# Altium schematic sheet HW-590W-0625-SCH-天德钰方案.SchDoc
size 566 x 736 mm; SheetNumber: 1; SheetTotal: 1
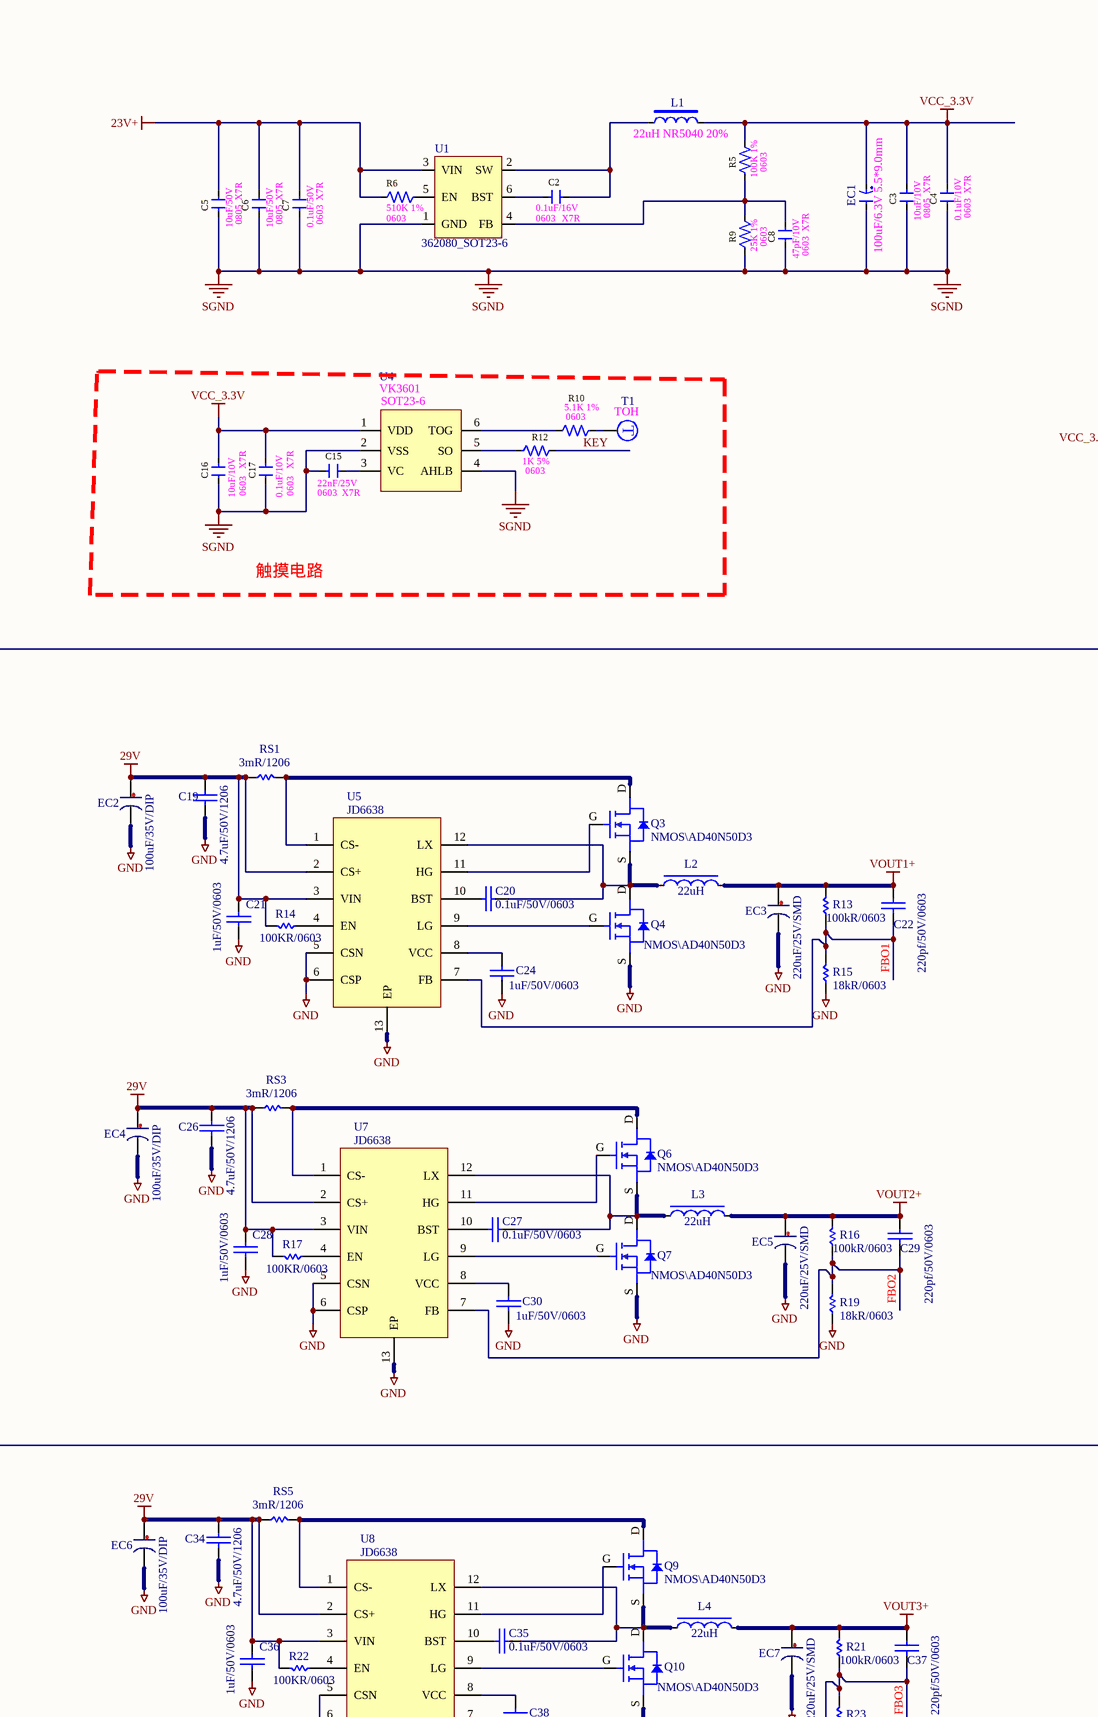
[diagram p0: HW-590W-0625-SCH-天德钰方案.SchDoc, top left]
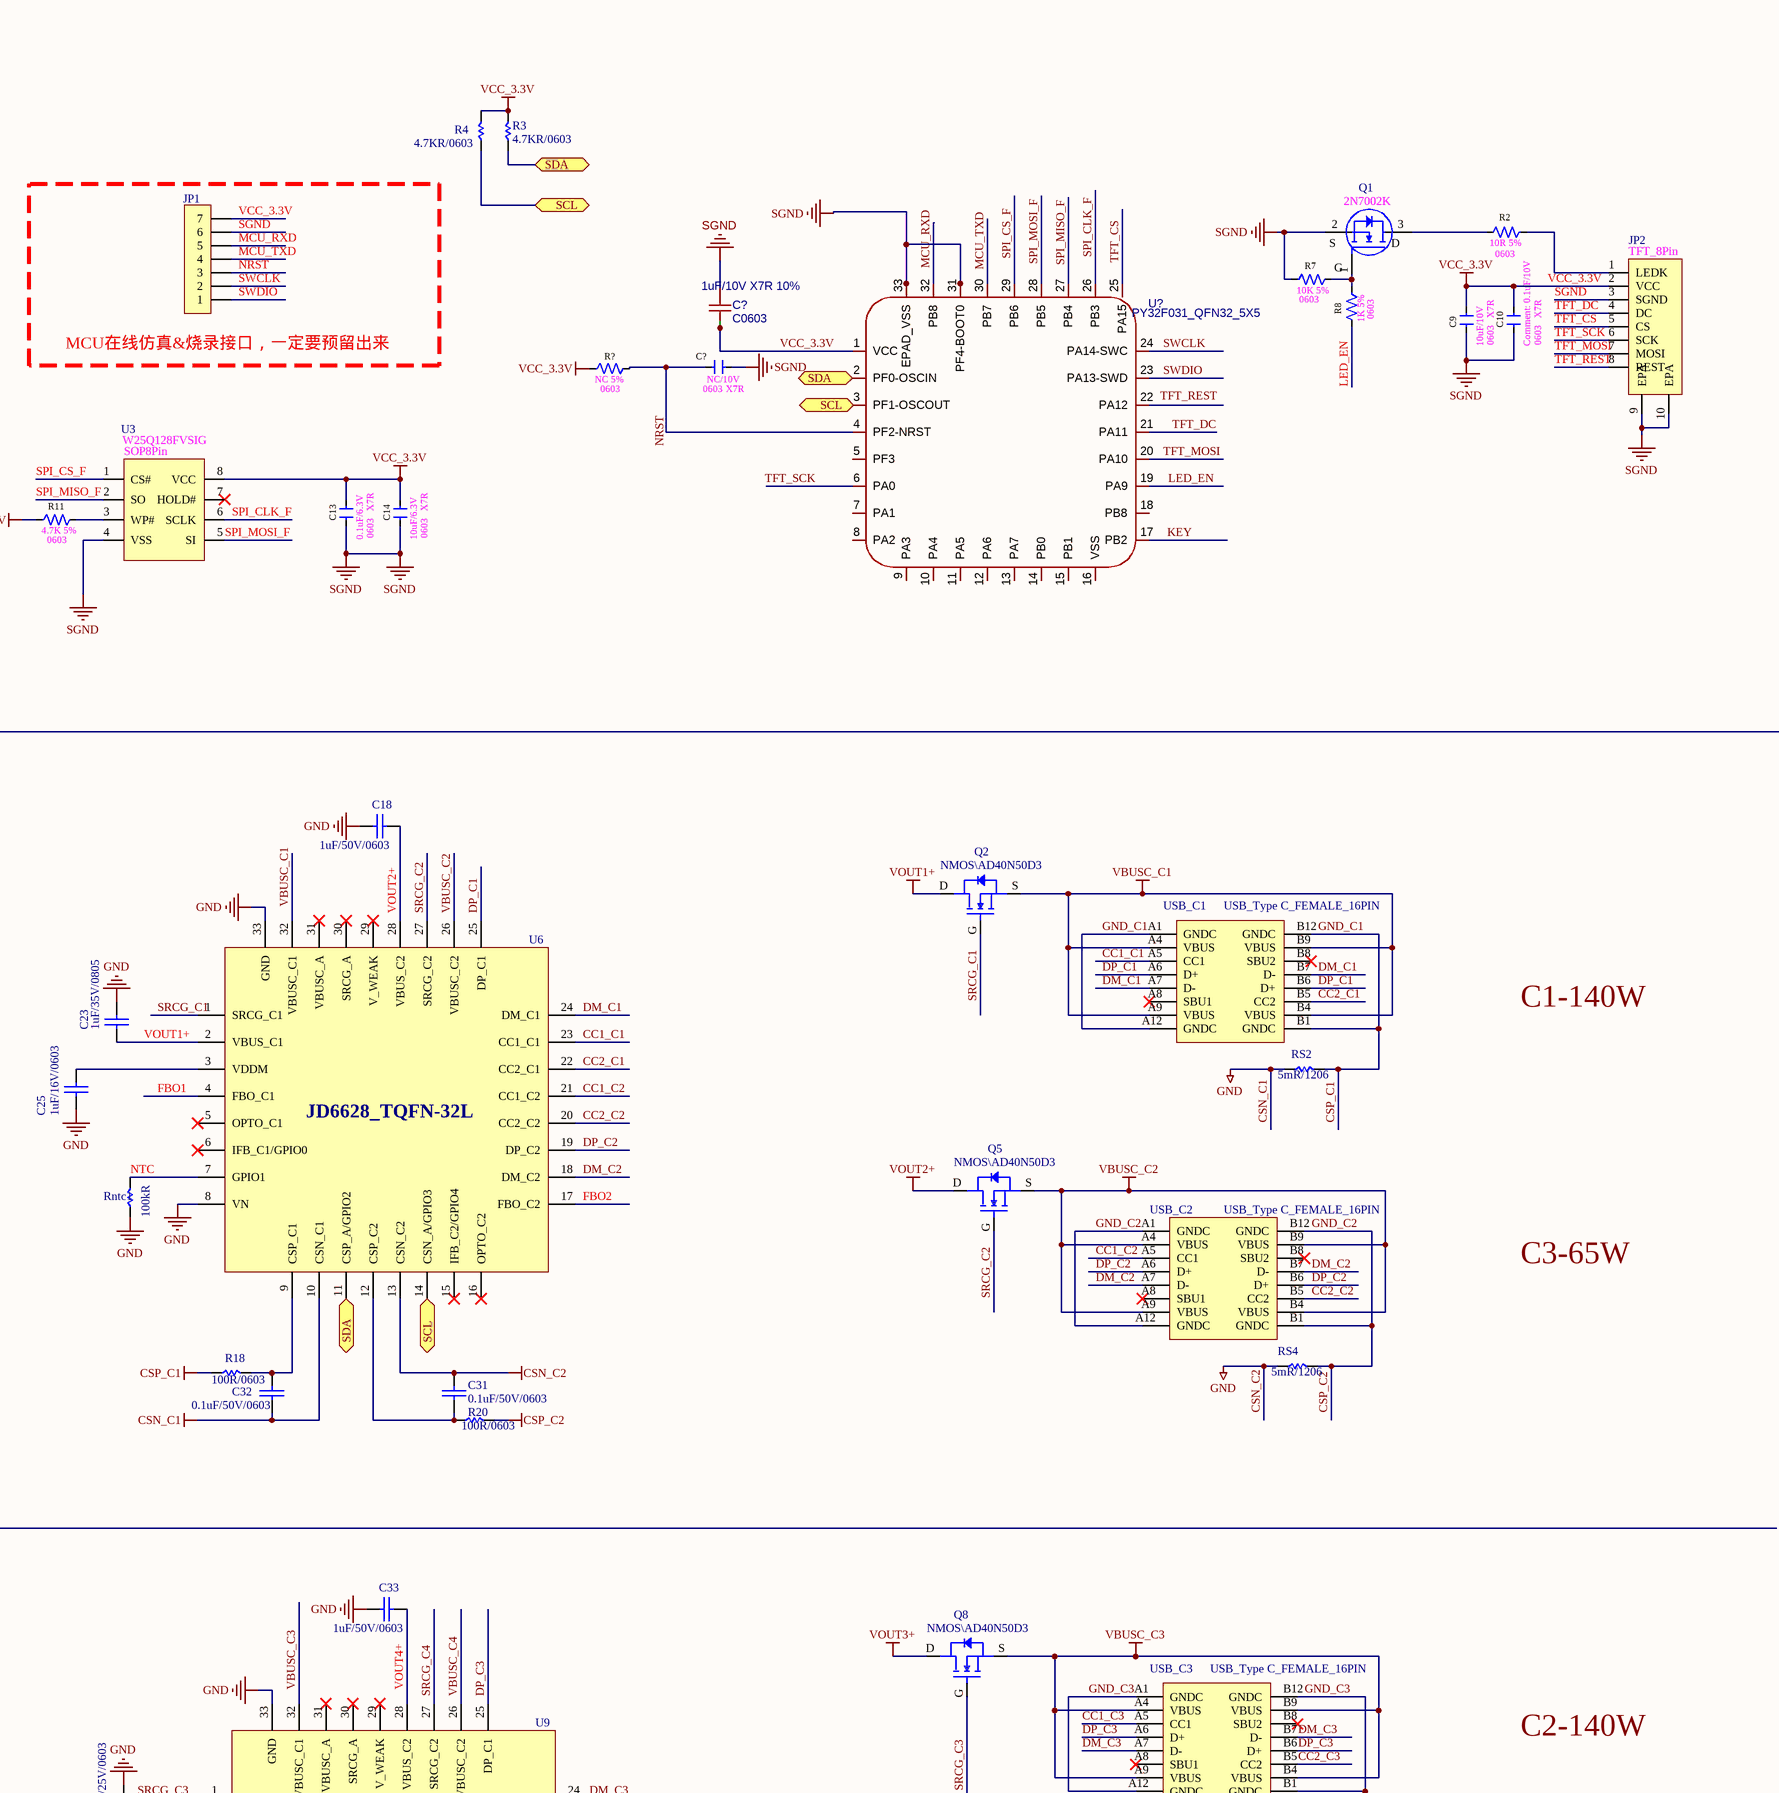
[diagram p1: HW-590W-0625-SCH-天德钰方案.SchDoc, top right]
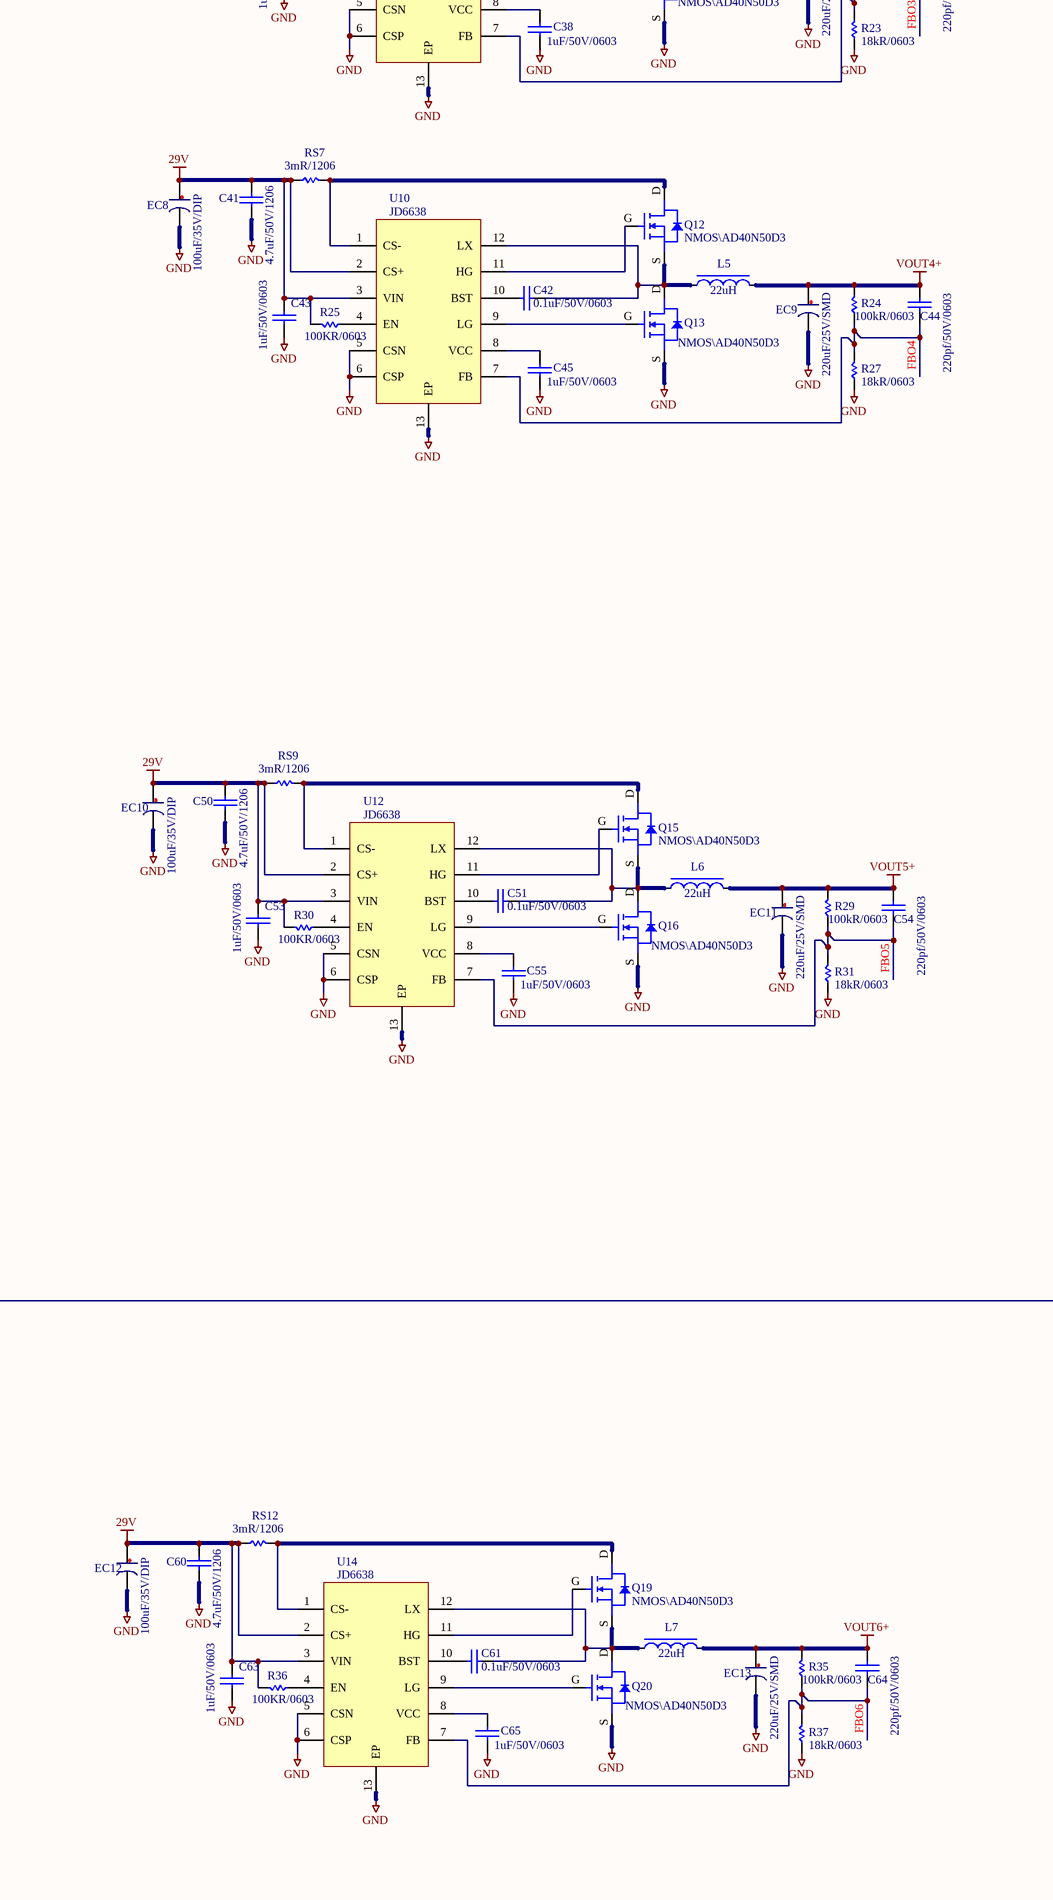
[diagram p2: HW-590W-0625-SCH-天德钰方案.SchDoc, bottom left]
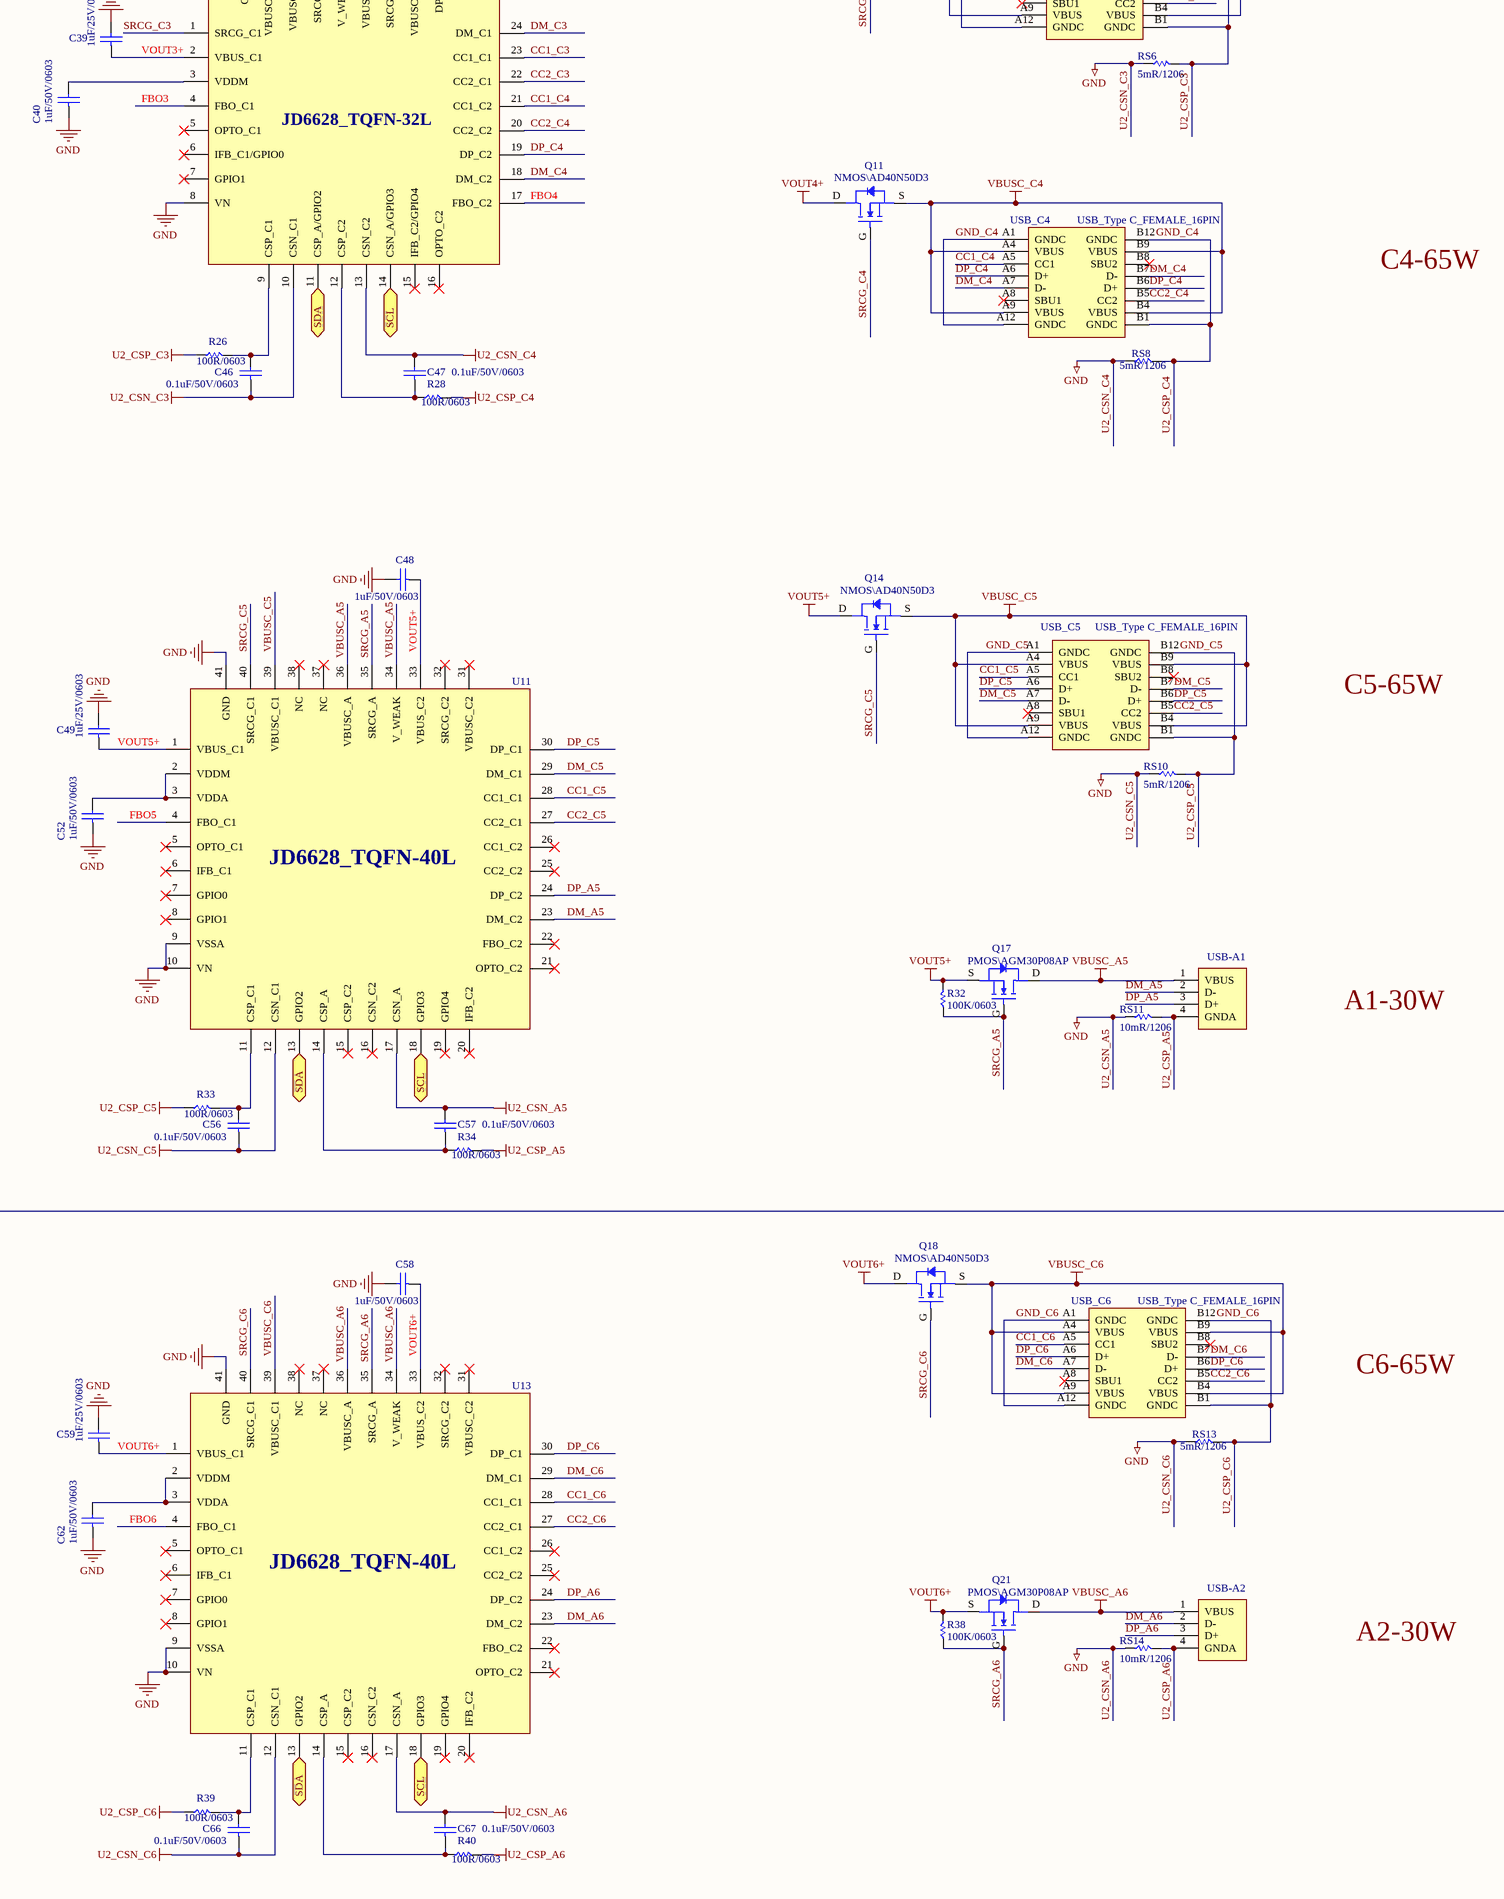
[diagram p3: HW-590W-0625-SCH-天德钰方案.SchDoc, bottom right]

## Parts
(Parts that share a designator on the sheet are numbered #1, #2 ... from top to bottom, then left to right.)
C2  0.1uF/16V  封装: 0603  材质: X7R  [SMD-C0603 锡膏]
C3  10uF/10V  封装: 0805  材质: X7R  [SMD-C0805 锡膏]
C4  0.1uF/10V  封装: 0603  材质: X7R  [SMD-C0603 锡膏]
C5  10uF/50V  封装: 0805  材质: X7R  [SMD-C0805 锡膏]
C6  10uF/50V  封装: 0805  材质: X7R  [SMD-C0805 锡膏]
C7  0.1uF/50V  封装: 0603  材质: X7R  [SMD-C0603 锡膏]
C8  47pF/10V  封装: 0603  材质: X7R  [SMD-C0603 锡膏]
C9  10uF/10V  封装: 0603  材质: X7R  [SMD-C0603 锡膏]
C10  0.1uF/10V  封装: 0603  材质: X7R  [SMD-C0603 锡膏]
C13  0.1uF/6.3V  封装: 0603  材质: X7R  [SMD-C0603 锡膏]
C14  10uF/6.3V  封装: 0603  材质: X7R  [SMD-C0603 锡膏]
C15  22nF/25V  封装: 0603  材质: X7R  [SMD-C0603 锡膏]
C16  10uF/10V  封装: 0603  材质: X7R  [SMD-C0603 锡膏]
C17  0.1uF/10V  封装: 0603  材质: X7R  [SMD-C0603 锡膏]
C18  1uF/50V/0603  [C0603]
C19  4.7uF/50V/1206  [C0603]
C20  0.1uF/50V/0603  [C0603]
C21  1uF/50V/0603  [C0603]
C22  220pf/50V/0603  [C0603]
C23  1uF/35V/0805  [C0603]
C24  1uF/50V/0603  [C0603]
C25  1uF/16V/0603  [C0603]
C26  4.7uF/50V/1206  [C0603]
C27  0.1uF/50V/0603  [C0603]
C28  1uF/50V/0603  [C0603]
C29  220pf/50V/0603  [C0603]
C30  1uF/50V/0603  [C0603]
C31  0.1uF/50V/0603  [C0603]
C32  0.1uF/50V/0603  [C0603]
C33  1uF/50V/0603  [C0603]
C34  4.7uF/50V/1206  [C0603]
C35  0.1uF/50V/0603  [C0603]
C36  1uF/50V/0603  [C0603]
C37  220pf/50V/0603  [C0603]
C38  1uF/50V/0603  [C0603]
C39  1uF/25V/0603  [C0603]
C40  1uF/50V/0603  [C0603]
C41  4.7uF/50V/1206  [C0603]
C42  0.1uF/50V/0603  [C0603]
C43  1uF/50V/0603  [C0603]
C44  220pf/50V/0603  [C0603]
C45  1uF/50V/0603  [C0603]
C46  0.1uF/50V/0603  [C0603]
C47  0.1uF/50V/0603  [C0603]
C48  1uF/50V/0603  [C0603]
C49  1uF/25V/0603  [C0603]
C50  4.7uF/50V/1206  [C0603]
C51  0.1uF/50V/0603  [C0603]
C52  1uF/50V/0603  [C0603]
C53  1uF/50V/0603  [C0603]
C54  220pf/50V/0603  [C0603]
C55  1uF/50V/0603  [C0603]
C56  0.1uF/50V/0603  [C0603]
C57  0.1uF/50V/0603  [C0603]
C58  1uF/50V/0603  [C0603]
C59  1uF/25V/0603  [C0603]
C60  4.7uF/50V/1206  [C0603]
C61  0.1uF/50V/0603  [C0603]
C62  1uF/50V/0603  [C0603]
C63  1uF/50V/0603  [C0603]
C64  220pf/50V/0603  [C0603]
C65  1uF/50V/0603  [C0603]
C66  0.1uF/50V/0603  [C0603]
C67  0.1uF/50V/0603  [C0603]
C?#1  1uF/10V X7R 10%  value C0603  [C0603]
C?#2  NC/10V  封装: 0603  材质: X7R  [SMD-C0603 锡膏]
EC1  100uF/6.3V 5.5*9.0mm  [DIP-CAP 2.5mm 6.3*7mm 立式]
EC2  100uF/35V/DIP  [CE\P3.5mm\D8mm]
EC3  220uF/25V/SMD  [CE\P3.5mm\D8mm]
EC4  100uF/35V/DIP  [CE\P3.5mm\D8mm]
EC5  220uF/25V/SMD  [CE\P3.5mm\D8mm]
EC6  100uF/35V/DIP  [CE\P3.5mm\D8mm]
EC7  220uF/25V/SMD  [CE\P3.5mm\D8mm]
EC8  100uF/35V/DIP  [CE\P3.5mm\D8mm]
EC9  220uF/25V/SMD  [CE\P3.5mm\D8mm]
EC10  100uF/35V/DIP  [CE\P3.5mm\D8mm]
EC11  220uF/25V/SMD  [CE\P3.5mm\D8mm]
EC12  100uF/35V/DIP  [CE\P3.5mm\D8mm]
EC13  220uF/25V/SMD  [CE\P3.5mm\D8mm]
JP1  HDR-1X7  [HDR-1X7]  (value not drawn)
JP2  TFT_8Pin  [FPC_8P 0.5MM]
L1  22uH NR5040 20%  [SMD-L NR5040 锡膏]
L2  22uH  [IND\AMPI0630\5.9MM(DIP+SMD)]
L3  22uH  [IND\AMPI0630\5.9MM(DIP+SMD)]
L4  22uH  [IND\AMPI0630\5.9MM(DIP+SMD)]
L5  22uH  [IND\AMPI0630\5.9MM(DIP+SMD)]
L6  22uH  [IND\AMPI0630\5.9MM(DIP+SMD)]
L7  22uH  [IND\AMPI0630\5.9MM(DIP+SMD)]
Q1  2N7002K  [SOT23-3 红胶]
Q2  NMOS\AD40N50D3  [MOS\SOP-8]
Q3  NMOS\AD40N50D3  [MOS\DFN-8(3x3)]
Q4  NMOS\AD40N50D3  [MOS\DFN-8(3x3)]
Q5  NMOS\AD40N50D3  [MOS\SOP-8]
Q6  NMOS\AD40N50D3  [MOS\DFN-8(3x3)]
Q7  NMOS\AD40N50D3  [MOS\DFN-8(3x3)]
Q8  NMOS\AD40N50D3  [MOS\SOP-8]
Q9  NMOS\AD40N50D3  [MOS\DFN-8(3x3)]
Q10  NMOS\AD40N50D3  [MOS\DFN-8(3x3)]
Q11  NMOS\AD40N50D3  [MOS\SOP-8]
Q12  NMOS\AD40N50D3  [MOS\DFN-8(3x3)]
Q13  NMOS\AD40N50D3  [MOS\DFN-8(3x3)]
Q14  NMOS\AD40N50D3  [MOS\SOP-8]
Q15  NMOS\AD40N50D3  [MOS\DFN-8(3x3)]
Q16  NMOS\AD40N50D3  [MOS\DFN-8(3x3)]
Q17  PMOS\AGM30P08AP  [MOS\SOP-8]
Q18  NMOS\AD40N50D3  [MOS\SOP-8]
Q19  NMOS\AD40N50D3  [MOS\DFN-8(3x3)]
Q20  NMOS\AD40N50D3  [MOS\DFN-8(3x3)]
Q21  PMOS\AGM30P08AP  [MOS\SOP-8]
R2  10R 5%  封装: 0603  [SMD-R0603 锡膏]
R3  4.7KR/0603  [R0603]
R4  4.7KR/0603  [R0603]
R5  100K 1%  封装: 0603  [SMD-R0603 锡膏]
R6  510K 1%  封装: 0603  [SMD-R0603 锡膏]
R7  10K 5%  封装: 0603  [SMD-R0603 锡膏]
R8  1K 5%  封装: 0603  [SMD-R0603 锡膏]
R9  25K 1%  封装: 0603  [SMD-R0603 锡膏]
R10  5.1K 1%  封装: 0603  [SMD-R0603 锡膏]
R11  4.7K 5%  封装: 0603  [SMD-R0603 锡膏]
R12  1K 5%  封装: 0603  [SMD-R0603 锡膏]
R13  100kR/0603  [R0603]
R14  100KR/0603  [R0603S]
R15  18kR/0603  [R0603]
R16  100kR/0603  [R0603]
R17  100KR/0603  [R0603S]
R18  100R/0603  [R0603]
R19  18kR/0603  [R0603]
R20  100R/0603  [R0603]
R21  100kR/0603  [R0603]
R22  100KR/0603  [R0603S]
R23  18kR/0603  [R0603]
R24  100kR/0603  [R0603]
R25  100KR/0603  [R0603S]
R26  100R/0603  [R0603]
R27  18kR/0603  [R0603]
R28  100R/0603  [R0603]
R29  100kR/0603  [R0603]
R30  100KR/0603  [R0603S]
R31  18kR/0603  [R0603]
R32  100K/0603  [R0603]
R33  100R/0603  [R0603]
R34  100R/0603  [R0603]
R35  100kR/0603  [R0603]
R36  100KR/0603  [R0603S]
R37  18kR/0603  [R0603]
R38  100K/0603  [R0603]
R39  100R/0603  [R0603]
R40  100R/0603  [R0603]
R?  NC 5%  封装: 0603  [SMD-R0603 锡膏]
Rntc1  100kR  [R0603]
RS1  3mR/1206  [R1206]
RS2  5mR/1206  [R2512]
RS3  3mR/1206  [R1206]
RS4  5mR/1206  [R2512]
RS5  3mR/1206  [R1206]
RS6  5mR/1206  [R2512]
RS7  3mR/1206  [R1206]
RS8  5mR/1206  [R2512]
RS9  3mR/1206  [R1206]
RS10  5mR/1206  [R2512]
RS11  10mR/1206  [R2512]
RS12  3mR/1206  [R1206]
RS13  5mR/1206  [R2512]
RS14  10mR/1206  [R2512]
T1  TOH  [Test Point]
U1  362080_SOT23-6  [SOT23-6]
U3  W25Q128FVSIG  Fotprintf: SOP8Pin  [SOP_8L 锡膏]
U4  VK3601  Footprintf: SOT23-6  [SOT23-6 锡膏]
U5  JD6638_TDFN_12L  [TDFN_3X3_12L]  (value not drawn)
U6  JD6628_TQFN-32L  [IC\QFN-32\0.4mm\4x4mm]
U7  JD6638_TDFN_12L  [TDFN_3X3_12L]  (value not drawn)
U8  JD6638_TDFN_12L  [TDFN_3X3_12L]  (value not drawn)
U9  JD6628_TQFN-32L  [IC\QFN-32\0.4mm\4x4mm]
U10  JD6638_TDFN_12L  [TDFN_3X3_12L]  (value not drawn)
U11  JD6628_TQFN-40L  [QFN5*5-40L]
U12  JD6638_TDFN_12L  [TDFN_3X3_12L]  (value not drawn)
U13  JD6628_TQFN-40L  [QFN5*5-40L]
U14  JD6638_TDFN_12L  [TDFN_3X3_12L]  (value not drawn)
U?  PY32F031_QFN32_5X5
USB-A1  USB_Type A_FEMALE_SMD_Short  [USB_USAF-041N-4WV611]  (value not drawn)
USB-A2  USB_Type A_FEMALE_SMD_Short  [USB_USAF-041N-4WV611]  (value not drawn)
USB_C1  USB_Type C_FEMALE_16PIN  [USB_SBC-160S1-20-S235]
USB_C2  USB_Type C_FEMALE_16PIN  [USB_SBC-160S1-20-S235]
USB_C3  USB_Type C_FEMALE_16PIN  [USB_SBC-160S1-20-S235]
USB_C4  USB_Type C_FEMALE_16PIN  [USB_SBC-160S1-20-S235]
USB_C5  USB_Type C_FEMALE_16PIN  [USB_SBC-160S1-20-S235]
USB_C6  USB_Type C_FEMALE_16PIN  [USB_SBC-160S1-20-S235]

## Blocks framed on the sheet
MCU在线仿真&烧录接口，一定要预留出来: JP1
触摸电路: C15-C17 R10 R12 T1 U4

## Ports
SCL (bidir), SDA (bidir)

## Nets
23V+: C5.1 C6.1 C7.1 R6.1 U1.3(VIN)
29V: C19.2 C21.2 C26.2 C28.2 C34.2 C36.2 C41.2 C43.2 C50.2 C53.2 C60.2 C63.2 EC2.1 EC4.1 EC6.1 EC8.1 EC10.1 EC12.1 R14.2 R17.2 R22.2 R25.2 R30.2 R36.2 RS1.1 RS3.1 RS5.1 RS7.1 RS9.1 RS12.1 U5.2(CS+) U5.3(VIN) U7.2(CS+) U7.3(VIN) U8.2(CS+) U8.3(VIN) U10.2(CS+) U10.3(VIN) U12.2(CS+) U12.3(VIN) U14.2(CS+) U14.3(VIN)
CSN_C1: C18.2 C19.1 C21.1 C23.2 C24.1 C25.1 C26.1 C28.1 C30.1 C31.2 C32.1 C33.2 C34.1 C36.1 C38.1 C39.2 C40.1 C41.1 C43.1 C45.1 C46.1 C47.2 C48.2 C49.2 C50.1 C52.1 C53.1 C55.1 C56.1 C57.2 C58.2 C59.2 C60.1 C62.1 C63.1 C65.1 C66.1 C67.2 EC2.2 EC3.2 EC4.2 EC5.2 EC6.2 EC7.2 EC8.2 EC9.2 EC10.2 EC11.2 EC12.2 EC13.2 Q4.S Q7.S Q10.S Q13.S Q16.S Q20.S R15.1 R19.1 R23.1 R27.1 R31.1 R37.1 Rntc1.1 RS2.1 RS4.1 RS6.1 RS8.1 RS10.1 RS11.1 RS13.1 RS14.1 U5.5(CSN) U5.6(CSP) U5.13(EP) U6.8(VN) U6.10(CSN_C1) U6.13(CSN_C2) U6.33(GND) U7.5(CSN) U7.6(CSP) U7.13(EP) U8.5(CSN) U8.6(CSP) U8.13(EP) U9.8(VN) U9.10(CSN_C1) U9.13(CSN_C2) U9.33(GND) U10.5(CSN) U10.6(CSP) U10.13(EP) U11.9(VSSA) U11.10(VN) U11.12(CSN_C1) U11.17(CSN_A) U11.41(GND) U12.5(CSN) U12.6(CSP) U12.13(EP) U13.9(VSSA) U13.10(VN) U13.12(CSN_C1) U13.17(CSN_A) U13.41(GND) U14.5(CSN) U14.6(CSP) U14.13(EP)  [also labelled CSN_C2, GND, U2_CSN_A5, U2_CSN_A6, U2_CSN_C3, U2_CSN_C4, U2_CSN_C5, U2_CSN_C6]
CSP_C1: R18.1 RS2.2 USB_C1.A1(GNDC) USB_C1.A12(GNDC) USB_C1.B1(GNDC) USB_C1.B12(GNDC)  [also labelled GND_C1]
CSP_C2: R20.2 RS4.2 USB_C2.A1(GNDC) USB_C2.A12(GNDC) USB_C2.B1(GNDC) USB_C2.B12(GNDC)  [also labelled GND_C2]
GND_C3: R26.1 RS6.2 USB_C3.A1(GNDC) USB_C3.A12(GNDC) USB_C3.B1(GNDC) USB_C3.B12(GNDC)  [also labelled U2_CSP_C3]
GND_C4: R28.2 RS8.2 USB_C4.A1(GNDC) USB_C4.A12(GNDC) USB_C4.B1(GNDC) USB_C4.B12(GNDC)  [also labelled U2_CSP_C4]
GND_C5: R33.1 RS10.2 USB_C5.A1(GNDC) USB_C5.A12(GNDC) USB_C5.B1(GNDC) USB_C5.B12(GNDC)  [also labelled U2_CSP_C5]
GND_C6: R39.1 RS13.2 USB_C6.A1(GNDC) USB_C6.A12(GNDC) USB_C6.B1(GNDC) USB_C6.B12(GNDC)  [also labelled U2_CSP_C6]
SGND: C3.2 C4.2 C5.2 C6.2 C7.2 C8.2 C9.1 C10.1 C13.1 C14.1 C15.2 C16.1 C17.1 C?#1.2 C?#2.1 EC1.2 JP1.6 JP2.3(SGND) JP2.9(EPA) JP2.10(EPA) Q1.2(S) R7.2 R9.2 U1.1(GND) U3.4(VSS) U4.2(VSS) U4.4(AHLB) U?.31(PF4-BOOT0) U?.33(EPAD_VSS)
U2_CSP_A5: R34.2 RS11.2 USB-A1.4(GNDA)
U2_CSP_A6: R40.2 RS14.2 USB-A2.4(GNDA)
VBUSC_A5: Q17.D U11.34(V_WEAK) U11.36(VBUSC_A) USB-A1.1(VBUS)
VBUSC_A6: Q21.D U13.34(V_WEAK) U13.36(VBUSC_A) USB-A2.1(VBUS)
VBUSC_C1: Q2.S U6.32(VBUSC_C1) USB_C1.A4(VBUS) USB_C1.A9(VBUS) USB_C1.B4(VBUS) USB_C1.B9(VBUS)
VBUSC_C2: Q5.S U6.26(VBUSC_C2) USB_C2.A4(VBUS) USB_C2.A9(VBUS) USB_C2.B4(VBUS) USB_C2.B9(VBUS)
VBUSC_C3: Q8.S U9.32(VBUSC_C1) USB_C3.A4(VBUS) USB_C3.A9(VBUS) USB_C3.B4(VBUS) USB_C3.B9(VBUS)
VBUSC_C4: Q11.S U9.26(VBUSC_C2) USB_C4.A4(VBUS) USB_C4.A9(VBUS) USB_C4.B4(VBUS) USB_C4.B9(VBUS)
VBUSC_C5: Q14.S U11.39(VBUSC_C1) USB_C5.A4(VBUS) USB_C5.A9(VBUS) USB_C5.B4(VBUS) USB_C5.B9(VBUS)
VBUSC_C6: Q18.S U13.39(VBUSC_C1) USB_C6.A4(VBUS) USB_C6.A9(VBUS) USB_C6.B4(VBUS) USB_C6.B9(VBUS)
VCC_3.3V: C3.1 C4.1 C9.2 C10.2 C13.2 C14.2 C16.2 C17.2 C?#1.1 EC1.1 JP1.7 JP2.2(VCC) L1.2 R3.2 R4.2 R5.1 R11.2 R?.2 U3.8(VCC) U4.1(VDD) U?.1(VCC)
VOUT1+: C22.2 C23.1 EC3.1 L2.2 Q2.D R13.2 U6.2(VBUS_C1)
VOUT2+: C18.1 C29.2 EC5.1 L3.2 Q5.D R16.2 U6.28(VBUS_C2)
VOUT3+: C37.2 C39.1 EC7.1 L4.2 Q8.D R21.2 U9.2(VBUS_C1)
VOUT4+: C33.1 C44.2 EC9.1 L5.2 Q11.D R24.2 U9.28(VBUS_C2)
VOUT5+: C48.1 C49.1 C54.2 EC11.1 L6.2 Q14.D Q17.S R29.2 R32.2 U11.1(VBUS_C1) U11.33(VBUS_C2)
VOUT6+: C58.1 C59.1 C64.2 EC13.1 L7.2 Q18.D Q21.S R35.2 R38.2 U13.1(VBUS_C1) U13.33(VBUS_C2)
CC1_C1: U6.23(CC1_C1) USB_C1.A5(CC1)
CC1_C2: U6.21(CC1_C2) USB_C2.A5(CC1)
CC1_C3: U9.23(CC1_C1) USB_C3.A5(CC1)
CC1_C4: U9.21(CC1_C2) USB_C4.A5(CC1)
CC1_C5: U11.28(CC1_C1) USB_C5.A5(CC1)
CC1_C6: U13.28(CC1_C1) USB_C6.A5(CC1)
CC2_C1: U6.22(CC2_C1) USB_C1.B5(CC2)
CC2_C2: U6.20(CC2_C2) USB_C2.B5(CC2)
CC2_C3: U9.22(CC2_C1) USB_C3.B5(CC2)
CC2_C4: U9.20(CC2_C2) USB_C4.B5(CC2)
CC2_C5: U11.27(CC2_C1) USB_C5.B5(CC2)
CC2_C6: U13.27(CC2_C1) USB_C6.B5(CC2)
DM_A5: U11.23(DM_C2) USB-A1.2(D-)
DM_A6: U13.23(DM_C2) USB-A2.2(D-)
DM_C1: U6.24(DM_C1) USB_C1.A7(D-) USB_C1.B7(D-)
DM_C2: U6.18(DM_C2) USB_C2.A7(D-) USB_C2.B7(D-)
DM_C3: U9.24(DM_C1) USB_C3.A7(D-) USB_C3.B7(D-)
DM_C4: U9.18(DM_C2) USB_C4.A7(D-) USB_C4.B7(D-)
DM_C5: U11.29(DM_C1) USB_C5.A7(D-) USB_C5.B7(D-)
DM_C6: U13.29(DM_C1) USB_C6.A7(D-) USB_C6.B7(D-)
DP_A5: U11.24(DP_C2) USB-A1.3(D+)
DP_A6: U13.24(DP_C2) USB-A2.3(D+)
DP_C1: U6.25(DP_C1) USB_C1.A6(D+) USB_C1.B6(D+)
DP_C2: U6.19(DP_C2) USB_C2.A6(D+) USB_C2.B6(D+)
DP_C3: U9.25(DP_C1) USB_C3.A6(D+) USB_C3.B6(D+)
DP_C4: U9.19(DP_C2) USB_C4.A6(D+) USB_C4.B6(D+)
DP_C5: U11.30(DP_C1) USB_C5.A6(D+) USB_C5.B6(D+)
DP_C6: U13.30(DP_C1) USB_C6.A6(D+) USB_C6.B6(D+)
FBO1: C22.1 R13.1 R15.2 U5.7(FB) U6.4(FBO_C1)
FBO2: C29.1 R16.1 R19.2 U6.17(FBO_C2) U7.7(FB)
FBO3: C37.1 R21.1 R23.2 U8.7(FB) U9.4(FBO_C1)
FBO4: C44.1 R24.1 R27.2 U9.17(FBO_C2) U10.7(FB)
FBO5: C54.1 R29.1 R31.2 U11.4(FBO_C1) U12.7(FB)
FBO6: C64.1 R35.1 R37.2 U13.4(FBO_C1) U14.7(FB)
KEY: R12.1 U?.17(PB2)
LED_EN: R8.1 U?.19(PA9)
MCU_RXD: JP1.5 U?.32(PB8)
MCU_TXD: JP1.4 U?.30(PB7)
NRST: JP1.3
NTC: Rntc1.2 U6.7(GPIO1)
SCL: R4.1 U6.14(CSN_A/GPIO3) U9.14(CSN_A/GPIO3) U11.18(GPIO3) U13.18(GPIO3) ; port SCL
SDA: R3.1 U6.11(CSP_A/GPIO2) U9.11(CSP_A/GPIO2) U11.13(GPIO2) U13.13(GPIO2) U?.2(PF0-OSCIN) ; port SDA
SPI_CLK_F: U3.6(SCLK) U?.26(PB3)
SPI_CS_F: U3.1(CS#) U?.29(PB6)
SPI_MISO_F: U3.2(SO) U?.27(PB4)
SPI_MOSI_F: U3.5(SI) U?.28(PB5)
SRCG_A5: Q17.G R32.1 U11.35(SRCG_A)
SRCG_A6: Q21.G R38.1 U13.35(SRCG_A)
SRCG_C1: Q2.G U6.1(SRCG_C1)
SRCG_C2: Q5.G U6.27(SRCG_C2)
SRCG_C3: Q8.G U9.1(SRCG_C1)
SRCG_C4: Q11.G U9.27(SRCG_C2)
SRCG_C5: Q14.G U11.40(SRCG_C1)
SRCG_C6: Q18.G U13.40(SRCG_C1)
SWCLK: JP1.2 U?.24(PA14-SWC)
SWDIO: JP1.1 U?.23(PA13-SWD)
TFT_CS: JP2.5(CS) U?.25(PA15)
TFT_DC: JP2.4(DC) U?.21(PA11)
TFT_MOSI: JP2.7(MOSI) U?.20(PA10)
TFT_REST: JP2.8(REST)
TFT_SCK: JP2.6(SCK)
NetC2_1: C2.1 L1.1 U1.2(SW)
NetC2_2: C2.2 U1.6(BST)
NetC8_1: C8.1 R5.2 R9.1 U1.4(FB)
NetC15_1: C15.1 U4.3(VC)
NetC20_1: C20.1 U5.10(BST)
NetC20_2: C20.2 L2.1 Q3.S Q4.D U5.12(LX)
NetC24_2: C24.2 U5.8(VCC)
NetC25_2: C25.2 U6.3(VDDM)
NetC27_1: C27.1 U7.10(BST)
NetC27_2: C27.2 L3.1 Q6.S Q7.D U7.12(LX)
NetC30_2: C30.2 U7.8(VCC)
NetC31_1: C31.1 R20.1 U6.12(CSP_C2)
NetC32_2: C32.2 R18.2 U6.9(CSP_C1)
NetC35_1: C35.1 U8.10(BST)
NetC35_2: C35.2 L4.1 Q9.S Q10.D U8.12(LX)
NetC38_2: C38.2 U8.8(VCC)
NetC40_2: C40.2 U9.3(VDDM)
NetC42_1: C42.1 U10.10(BST)
NetC42_2: C42.2 L5.1 Q12.S Q13.D U10.12(LX)
NetC45_2: C45.2 U10.8(VCC)
NetC46_2: C46.2 R26.2 U9.9(CSP_C1)
NetC47_1: C47.1 R28.1 U9.12(CSP_C2)
NetC51_1: C51.1 U12.10(BST)
NetC51_2: C51.2 L6.1 Q15.S Q16.D U12.12(LX)
NetC52_2: C52.2 U11.2(VDDM) U11.3(VDDA)
NetC55_2: C55.2 U12.8(VCC)
NetC56_2: C56.2 R33.2 U11.11(CSP_C1)
NetC57_1: C57.1 R34.1 U11.14(CSP_A)
NetC61_1: C61.1 U14.10(BST)
NetC61_2: C61.2 L7.1 Q19.S Q20.D U14.12(LX)
NetC62_2: C62.2 U13.2(VDDM) U13.3(VDDA)
NetC65_2: C65.2 U14.8(VCC)
NetC66_2: C66.2 R39.2 U13.11(CSP_C1)
NetC67_1: C67.1 R40.1 U13.14(CSP_A)
NetC?#2_2: C?#2.2 R?.1 U?.4(PF2-NRST)
NetJP2_1: JP2.1(LEDK) R2.2
NetQ1_1: Q1.1(G) R7.1 R8.2
NetQ1_3: Q1.3(D) R2.1
NetQ3_D: Q3.D RS1.2 U5.1(CS-)
NetQ3_G: Q3.G U5.11(HG)
NetQ4_G: Q4.G U5.9(LG)
NetQ6_D: Q6.D RS3.2 U7.1(CS-)
NetQ6_G: Q6.G U7.11(HG)
NetQ7_G: Q7.G U7.9(LG)
NetQ9_D: Q9.D RS5.2 U8.1(CS-)
NetQ9_G: Q9.G U8.11(HG)
NetQ10_G: Q10.G U8.9(LG)
NetQ12_D: Q12.D RS7.2 U10.1(CS-)
NetQ12_G: Q12.G U10.11(HG)
NetQ13_G: Q13.G U10.9(LG)
NetQ15_D: Q15.D RS9.2 U12.1(CS-)
NetQ15_G: Q15.G U12.11(HG)
NetQ16_G: Q16.G U12.9(LG)
NetQ19_D: Q19.D RS12.2 U14.1(CS-)
NetQ19_G: Q19.G U14.11(HG)
NetQ20_G: Q20.G U14.9(LG)
NetR6_2: R6.2 U1.5(EN)
NetR10_1: R10.1 U4.6(TOG)
NetR10_2: R10.2 T1.1
NetR11_1: R11.1 U3.3(WP#)
NetR12_2: R12.2 U4.5(SO)
NetR14_1: R14.1 U5.4(EN)
NetR17_1: R17.1 U7.4(EN)
NetR22_1: R22.1 U8.4(EN)
NetR25_1: R25.1 U10.4(EN)
NetR30_1: R30.1 U12.4(EN)
NetR36_1: R36.1 U14.4(EN)

Not connected (* = marked no-connect by the designer): U3 7(HOLD#)*; U6 5(OPTO_C1)* 6(IFB_C1/GPIO0)* 15(IFB_C2/GPIO4)* 16(OPTO_C2)* 29(V_WEAK)* 30(SRCG_A)* 31(VBUSC_A)*; U9 5(OPTO_C1)* 6(IFB_C1/GPIO0)* 7(GPIO1)* 15(IFB_C2/GPIO4)* 16(OPTO_C2)* 29(V_WEAK)* 30(SRCG_A)* 31(VBUSC_A)*; U11 5(OPTO_C1)* 6(IFB_C1)* 7(GPIO0)* 8(GPIO1)* 15(CSP_C2)* 16(CSN_C2)* 19(GPIO4)* 20(IFB_C2)* 21(OPTO_C2)* 22(FBO_C2)* 25(CC2_C2)* 26(CC1_C2)* 31(VBUSC_C2)* 32(SRCG_C2)* 37(NC)* 38(NC)*; U13 5(OPTO_C1)* 6(IFB_C1)* 7(GPIO0)* 8(GPIO1)* 15(CSP_C2)* 16(CSN_C2)* 19(GPIO4)* 20(IFB_C2)* 21(OPTO_C2)* 22(FBO_C2)* 25(CC2_C2)* 26(CC1_C2)* 31(VBUSC_C2)* 32(SRCG_C2)* 37(NC)* 38(NC)*; U? 3(PF1-OSCOUT) 5(PF3) 6(PA0) 7(PA1) 8(PA2) 9(PA3) 10(PA4) 11(PA5) 12(PA6) 13(PA7) 14(PB0) 15(PB1) 16(VSS) 18(PB8) 22(PA12); USB_C1 A8(SBU1)* B8(SBU2)*; USB_C2 A8(SBU1)* B8(SBU2)*; USB_C3 A8(SBU1)* B8(SBU2)*; USB_C4 A8(SBU1)* B8(SBU2)*; USB_C5 A8(SBU1)* B8(SBU2)*; USB_C6 A8(SBU1)* B8(SBU2)*

## Notes on the sheet
- Labels drawn without touching a wire or pin: A1-30W, A2-30W, C1-140W, C2-140W, C3-65W, C4-65W, C5-65W, C6-65W, NRST, TFT_REST, TFT_SCK
- (in symbol JD6638_TDFN_12L) JD6638
- (in symbol SMD-Test points) T

## Library data of the parts
C2-C10 C13-C17 C?#2 = SMD-Capacitor: 贴片电容 无极性
C18-C67 = CAP
C?#1 = 1uF/10V X7R 10%: Capacitor; Symbol: Cap; AddInBom: yes; ModelId: fca5be93b99f4b5a9a2fd372d58c31d9; Device: 1uF/10V X7R 10%; Published: 8-Jun-2000; LatestRevisionDate: 17-Jul-2002; LatestRevisionNote: Re-released for DXP Platform.; PackageReference: RAD-0.3; Publisher: Altium Limited; DesignItemID: Cap; LibraryName: Miscellaneous Devices; FootprintName: C0603; ModelName: C0603
EC1 = DIP-ECapacitor: 插件电容
EC2-EC13 = C: Value: *
JP1 = Header 7: 7P接插件; 版权归属: 源创客; BOM名称: 7P接插件; 学习资源: www.ooocke.com
JP2 = TFT_8Pin: TFT显示屏
L1 = SMD-L: 贴片电感 小电流
L2-L7 = INDUCTOR
Q1 = N-MOS_STO23-3Pin 驱动朝右: N-MOS管
Q2 Q5 Q8 Q11 Q14 Q17 Q18 Q21 = MOS\NMOS\FKS4004: SOP-8
Q3 Q4 Q6 Q7 Q9 Q10 Q12 Q13 Q15 Q16 Q19 Q20 = MOS\NMOS\FKBB3006: DFN-8(3x3)
R2 R5-R12 R? = SMD-Resistor: 贴片电阻
R3 R4 R13-R40 Rntc1 RS1-RS14 = RES SMD
T1 = SMD-Test points: 测试点
U1 = BL8042D_SOT23-6
U3 = GD25Q16ETIG_SOP8Pin: 兆易创新
U4 = VK3601_SOT23-6: 触摸IC
U5 U7 U8 U10 U12 U14 = JD6638_TDFN_12L: JD6638_TDFN12L
U6 U9 = JD6628_TQFN-32L: TQFN-32L
U11 U13 = JD6628_TQFN-40L: TQFN-40L
U? = PY32F031_QFN32_5X5: Symbol: PY32F031_QFN32_4X4; AddInBom: yes; Device: PY32F031_QFN32_5X5; Origin Footprint: QFN32_5X5; DesignItemID: PY32F031_QFN32_4X4; LibraryName: Schlib
USB-A1 USB-A2 = USB_Type A_FEMALE_SMD_Short: 懂腹:USAF-041N-4WV611